# EAGLE design circuit (EAGLE 6.6.0)
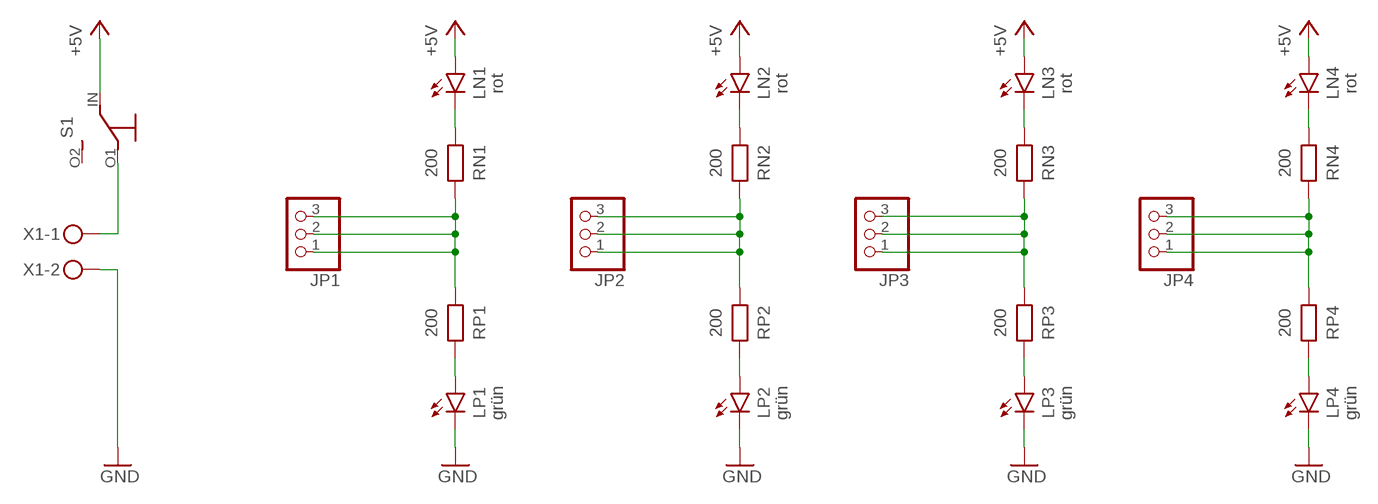
[diagram p0: schematic, sheet 1]

## Parts
JP1  PINHD-1X3  [1X03]
JP2  PINHD-1X3  [1X03]
JP3  PINHD-1X3  [1X03]
JP4  PINHD-1X3  [1X03]
LN1  rot  LED-3MM  [LED_3MM]
LN2  rot  LED-3MM  [LED_3MM]
LN3  rot  LED-3MM  [LED_3MM]
LN4  rot  LED-3MM  [LED_3MM]
LP1  grün  LED-3MM  [LED_3MM]
LP2  grün  LED-3MM  [LED_3MM]
LP3  grün  LED-3MM  [LED_3MM]
LP4  grün  LED-3MM  [LED_3MM]
RN1  200  RESISTOR-10MM  [R_THT_4]
RN2  200  RESISTOR-10MM  [R_THT_4]
RN3  200  RESISTOR-10MM  [R_THT_4]
RN4  200  RESISTOR-10MM  [R_THT_4]
RP1  200  RESISTOR-10MM  [R_THT_4]
RP2  200  RESISTOR-10MM  [R_THT_4]
RP3  200  RESISTOR-10MM  [R_THT_4]
RP4  200  RESISTOR-10MM  [R_THT_4]
S1  SCHALTER_UM-KIPP  [SCHALTER_KIPP_UM]
X1  STECKER_SPG_2  [STECKER_SPG_2]

## Nets
+5V: LN1.A LN2.A LN3.A LN4.A S1.IN
GND: LP1.K(C) LP2.K(C) LP3.K(C) LP4.K(C) X1.2
N$1: S1.O1 X1.1
N$2: LN1.K(C) RN1.2
N$3: JP2.1 JP2.2 JP2.3 RN2.1 RP2.2
N$4: LP2.A RP2.1
N$5: JP1.1 JP1.2 JP1.3 RN1.1 RP1.2
N$6: LN2.K(C) RN2.2
N$7: JP3.1 JP3.2 JP3.3 RN3.1 RP3.2
N$10: LP1.A RP1.1
N$12: LP3.A RP3.1
N$13: LN3.K(C) RN3.2
N$14: JP4.1 JP4.2 JP4.3 RN4.1 RP4.2
N$15: LP4.A RP4.1
N$16: LN4.K(C) RN4.2
Unconnected: S1.O2

## Library data of the parts
JP1-JP4 = pinhead:PINHD-1X3: PIN HEADER
LN1-LN4 LP1-LP4 = robo_ag:LED: Led Reichelt: LA E67B Variante: PLCC4 560-1400mcd 2,2V; 50mA Gelb-Orange SMD Reichelt: LA E67F Variante: PLCC4_REV 560mcd 2,65V; 50mA Orange SMD
RN1-RN4 RP1-RP4 = robo_ag:RESISTOR: Widerstand Reichelt: METALL x,xx[k]
S1 = robo_ag:SCHALTER_UM: Umschalter Reichelt: KIPP 1A11 Variante: KIPP Kippschalter mit Lötösen 5A bei 120V Reichelt: SS SMD402 Variante: SMD 24V 0,2A
X1 = robo_ag:STECKER_SPG_2: Anschlussklemme Reichelt:AKL 101-02 Nicht Anreihbar Reichelt:AKL 057-02 Anreihbar

## Board
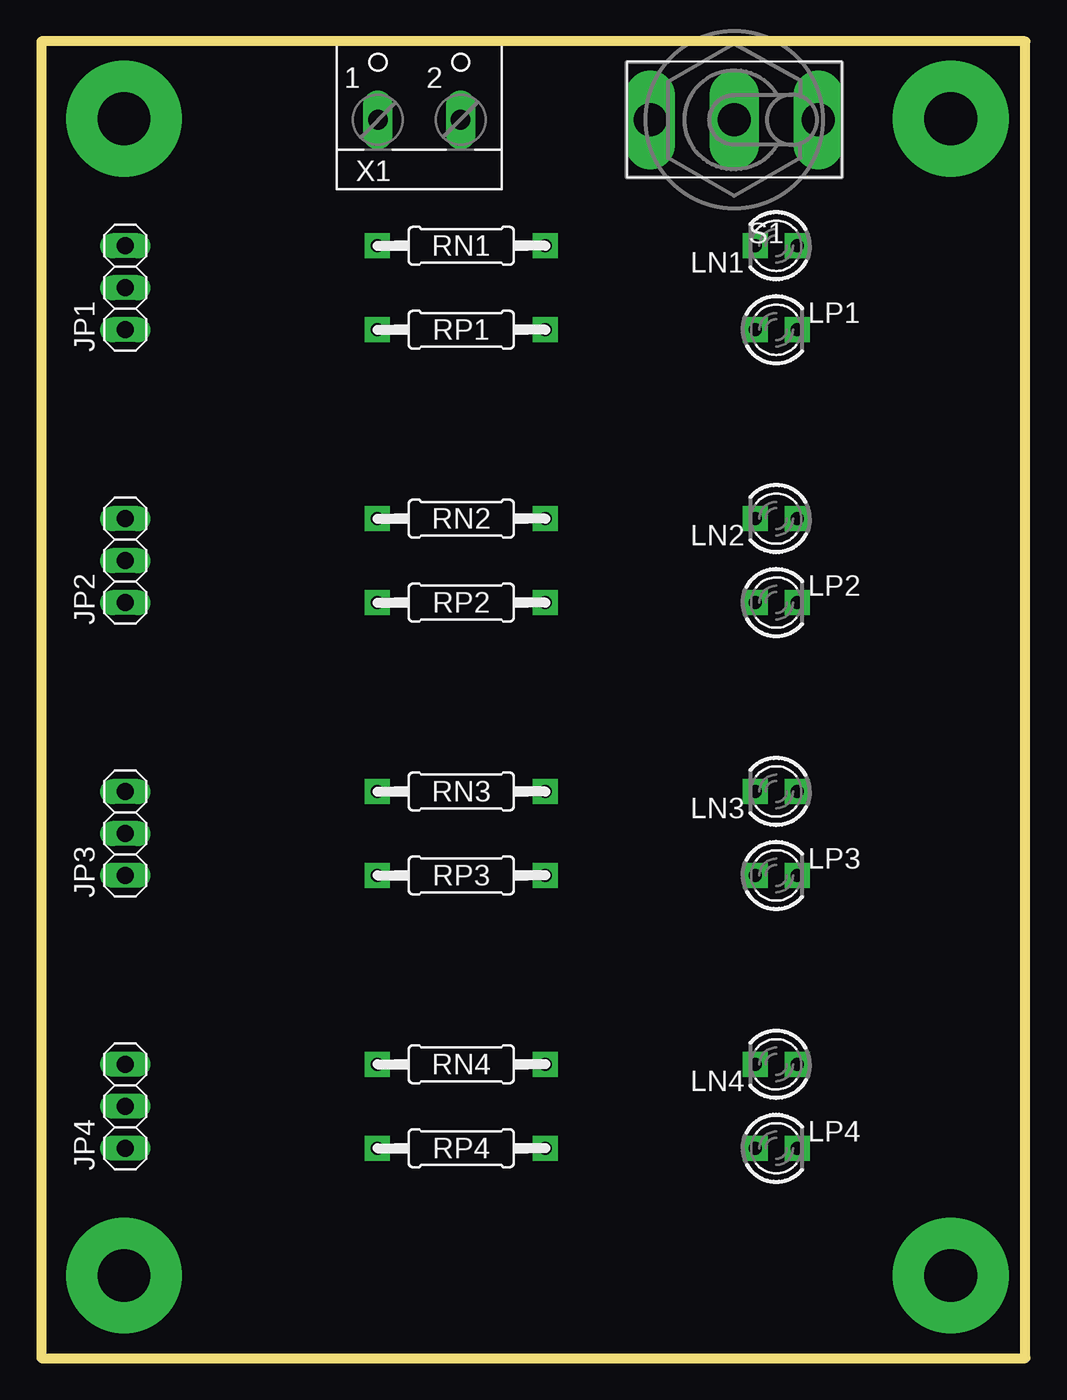
[diagram p1: board, top side]
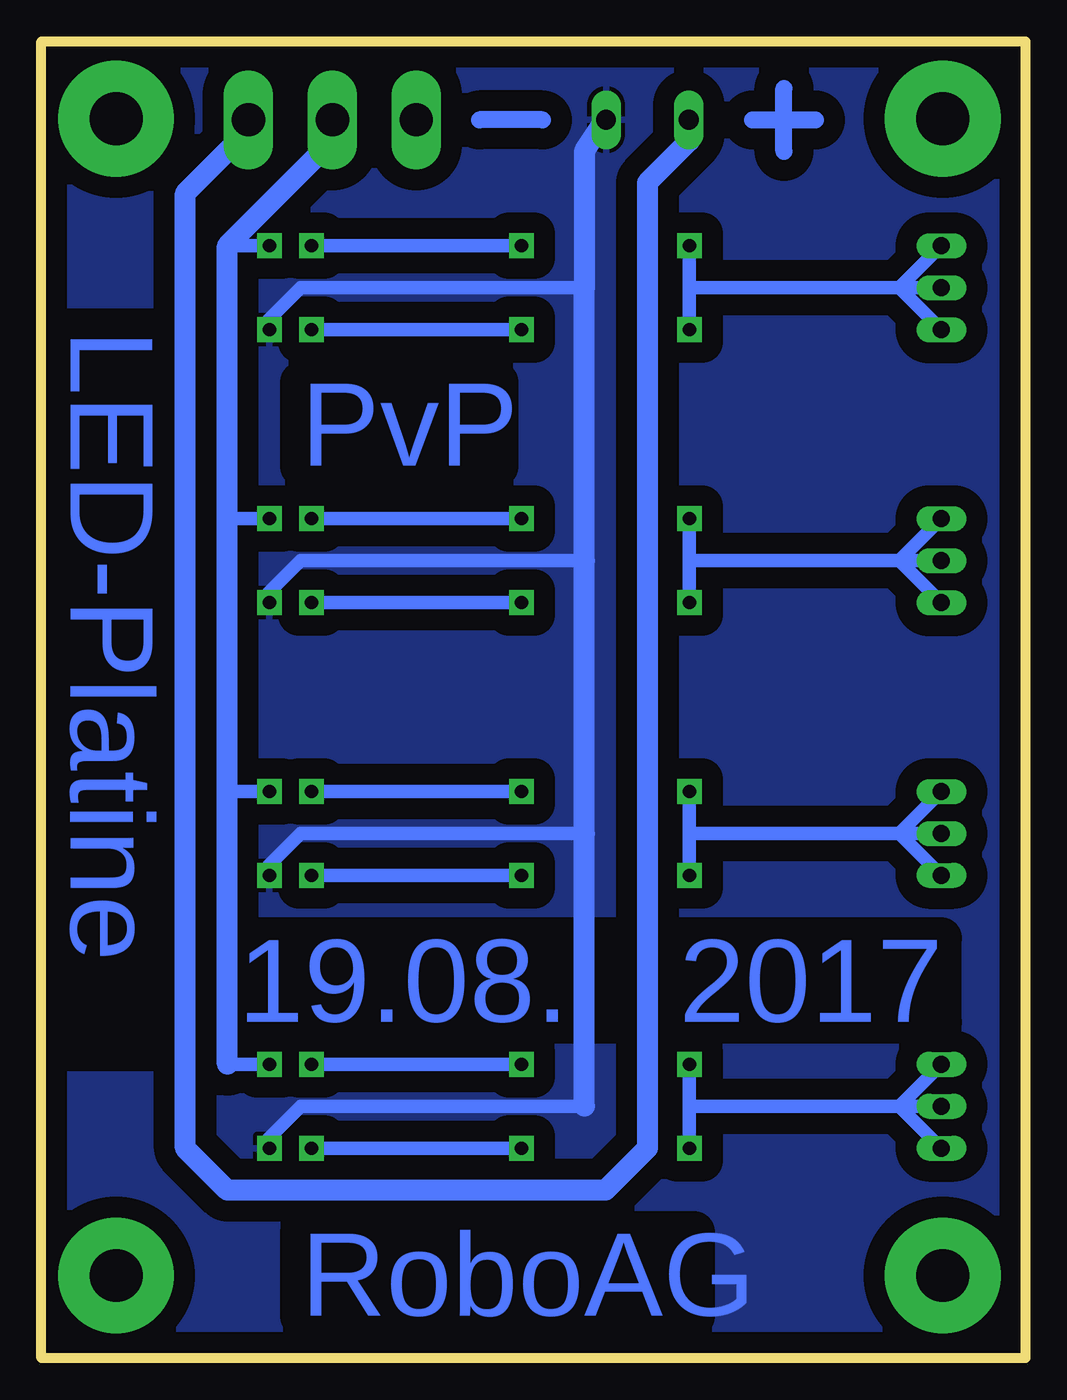
[diagram p2: board, bottom side, seen from below]

Size 59.52 x 79.68 mm. Coordinates in mm from the lower left corner, seen from the top.
Outline: 0,0 59.52,0 59.52,79.68 0,79.68 0,0
Copper layers (1*16): Top 0.035mm / dielectric 1.5mm / Bottom 0.035mm
Design rules "default": minimum track width 10mil, minimum drill 24mil, track to track 8mil, track to pad 8mil, pad to pad 8mil, via to via 8mil, smd to smd 8mil, copper to edge 40mil, drill to drill 8mil, minimum pad ring 10mil, minimum via ring 8mil, stop-mask expansion 4mil, vias tented up to drill 0mil, thermal gap 10mil

### Footprints (pad centres in the part's own frame; a part is rotated, then mirrored left to right if it is on the bottom)
1X03 = drill 1.016 long: 1 -2.54,0; 2 0,0; 3 2.54,0
LED_3MM = drill 0.8 pad 1.5 square: A -1.27,0; K 1.27,0
R_THT_4 = drill 0.8 pad 1.5 square: 1 -5.08,0; 2 5.08,0
SCHALTER_KIPP_UM = drill 2 pad 3 long: IN 0,0; O1 -5.08,0; O2 5.08,0
STECKER_SPG_2 = drill 1.194 long: 1 -2.5,-1.27; 2 2.5,-1.27

### Placement (x,y rotation side)
JP1  5.08,64.77 90 top
JP2  5.08,48.26 90 top
JP3  5.08,31.75 90 top
JP4  5.08,15.24 90 top
LN1  44.45,67.31 180 top
LN2  44.45,50.8 180 top
LN3  44.45,34.29 180 top
LN4  44.45,17.78 180 top
LP1  44.45,62.23 0 top
LP2  44.45,45.72 0 top
LP3  44.45,29.21 0 top
LP4  44.45,12.7 0 top
RN1  25.4,67.31 0 top
RN2  25.4,50.8 0 top
RN3  25.4,34.29 0 top
RN4  25.4,17.78 0 top
RP1  25.4,62.23 180 top
RP2  25.4,45.72 180 top
RP3  25.4,29.21 180 top
RP4  25.4,12.7 180 top
S1  41.91,74.93 180 top
X1  22.86,76.2 0 top

### Tracks (layer width: path | path; a pad name or v marks a point on that pad's centre or on a via)
+5V
  Bottom 0.813: LN1.A 48.26,67.31 | LN2.A 48.26,50.8 | LN3.A 48.26,34.29 | LN4.A 48.26,17.78
  Bottom 1.27: 48.26,17.78 48.26,34.29 48.26,50.8 48.26,67.31 41.91,73.66 S1.IN
GND
  Bottom 0.813: LP1.K 45.72,62.87 43.81,64.77 26.67,64.77 | LP2.K 45.72,46.35 43.81,48.26 26.67,48.26 | LP3.K 45.72,29.84 43.81,31.75 26.67,31.75 | LP4.K 45.72,13.34 43.81,15.24 26.67,15.24
  Bottom 1.016: X1.2 25.4,74.93
  Bottom 1.27: 26.67,15.24 26.67,31.75 26.67,48.26 26.67,64.77 26.67,73.03 25.4,74.93
  pour Bottom (isolate 1.27): 0,80.01 59.85,80.01 59.85,0 0,0
N$1
  Bottom 1.27: X1.1 20.32,74.89 20.32,73.66 22.86,71.12 22.86,12.7 25.4,10.16 48.26,10.16 50.8,12.7 50.8,70.48 46.99,74.3 S1.O1
N$2
  Bottom 0.813: RN1.2 LN1.K
N$3
  Bottom 0.813: RN2.1 20.32,48.26 | 20.32,48.26 7.62,48.26 | 7.62,48.26 JP2.2 | RP2.2 20.32,48.26 | JP2.3 7.62,48.26 | JP2.1 7.62,48.26
N$4
  Bottom 0.813: LP2.A RP2.1
N$5
  Bottom 0.813: RP1.2 20.32,64.77 | 20.32,64.77 7.62,64.77 | 7.62,64.77 JP1.2 | RN1.1 20.32,64.77 | JP1.3 7.62,64.77 | JP1.1 7.62,64.77
N$6
  Bottom 0.813: RN2.2 LN2.K
N$7
  Bottom 0.813: RN3.1 20.32,31.75 | 20.32,31.75 7.62,31.75 | 7.62,31.75 JP3.2 | RP3.2 20.32,31.75 | JP3.3 7.62,31.75 | JP3.1 7.62,31.75
N$8
  Bottom 1.016: 29.21,74.93 33.02,74.93
N$9
  Bottom 1.016: 16.51,74.93 12.7,74.93
N$10
  Bottom 0.813: RP1.1 LP1.A
N$11
  Bottom 1.016: 14.61,73.03 14.61,76.83
N$12
  Bottom 0.813: LP3.A RP3.1
N$13
  Bottom 0.813: RN3.2 LN3.K
N$14
  Bottom 0.813: RN4.1 20.32,15.24 | 20.32,15.24 7.62,15.24 | 7.62,15.24 JP4.2 | RP4.2 20.32,15.24 | JP4.3 7.62,15.24 | JP4.1 7.62,15.24
N$15
  Bottom 0.813: LP4.A RP4.1
N$16
  Bottom 0.813: RN4.2 LN4.K
N$27  (via drill 3.2 pad 7)
  other vias: 5,5
N$28  (via drill 3.2 pad 7)
  other vias: 55,5
N$29  (via drill 3.2 pad 7)
  other vias: 55,75
N$30  (via drill 3.2 pad 7)
  other vias: 5,75

### Text on the board
Bottom: LED-Platine | PvP | 2017 | 19.08. | RoboAG